# EAGLE design Adafruit MPR121Q QT (EAGLE 9.6.2)
COMPANY: ADAFRUIT INDUSTRIES; DRAWN: KTOWN; REV: A
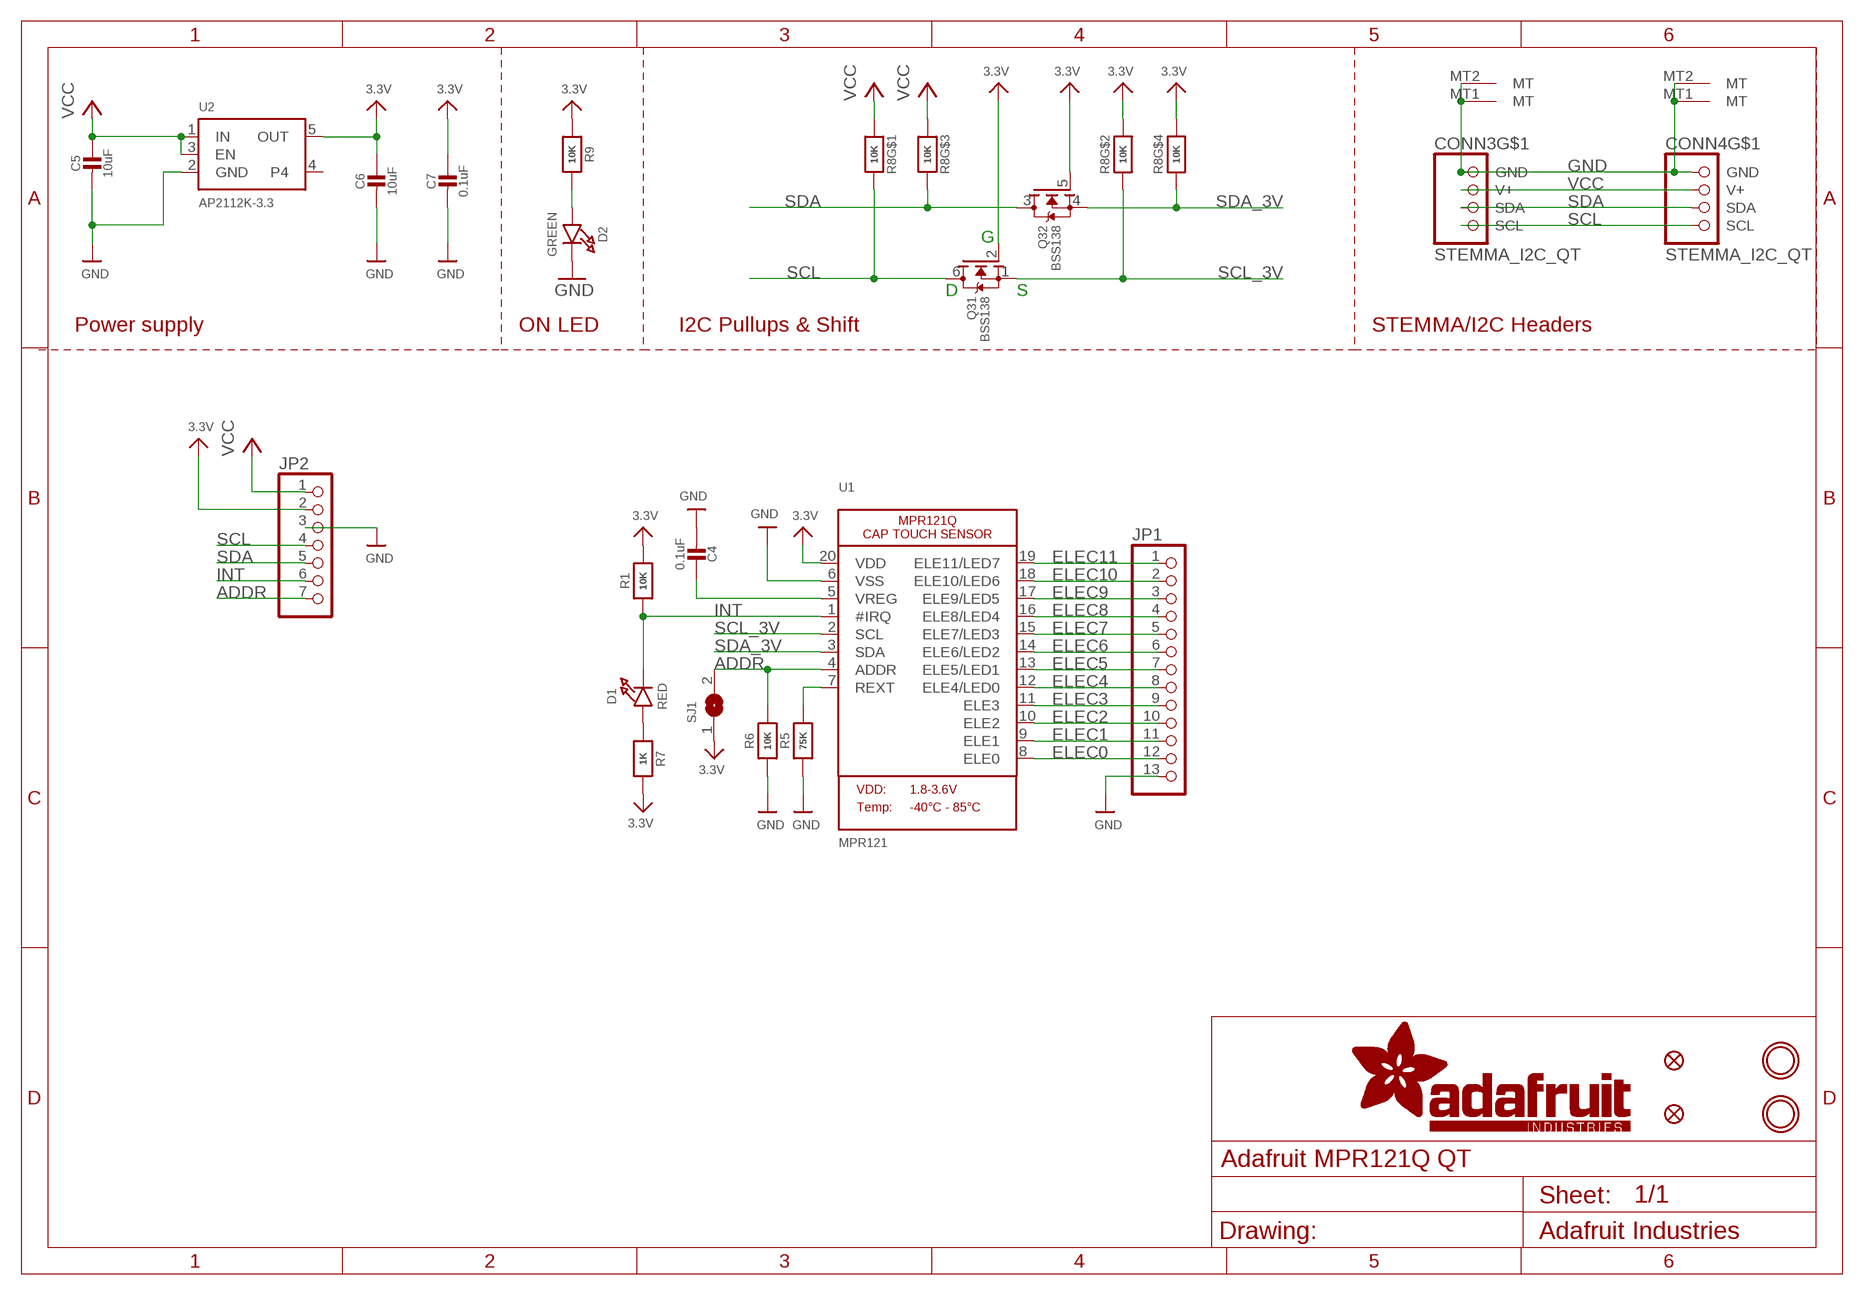
[diagram p0: schematic, sheet 1]

## Parts
C4  0.1uF  CAP_CERAMIC0603_NO  [0603-NO]
C5  10uF  CAP_CERAMIC0805-NOOUTLINE  [0805-NO]
C6  10uF  CAP_CERAMIC0805-NOOUTLINE  [0805-NO]
C7  0.1uF  CAP_CERAMIC0603_NO  [0603-NO]
CONN3  STEMMA_I2C_QT  [JST_SH4]
CONN4  STEMMA_I2C_QT  [JST_SH4]
D1  RED  LED0603_NOOUTLINE  [CHIPLED_0603_NOOUTLINE]
D2  GREEN  LED0603_NOOUTLINE  [CHIPLED_0603_NOOUTLINE]
FID3  FIDUCIAL_1MM  [FIDUCIAL_1MM]
FID4  FIDUCIAL_1MM  [FIDUCIAL_1MM]
JP1  HEADER-1X13  [1X13_ROUND_70]
JP2  HEADER-1X770MIL  [1X07_ROUND_70]
Q3  BSS138  MOSFET-N_DUAL  [SOT363]
R1  10K  RESISTOR_0603_NOOUT  [0603-NO]
R5  75K  RESISTOR_0603_NOOUT  [0603-NO]
R6  10K  RESISTOR_0603_NOOUT  [0603-NO]
R7  1K  RESISTOR_0603_NOOUT  [0603-NO]
R8  10K  RESISTOR_4PACK  [RESPACK_4X0603]
R9  10K  RESISTOR_0603_NOOUT  [0603-NO]
SJ1  SOLDERJUMPER  [SOLDERJUMPER_ARROW_NOPASTE]
U1  MPR121  MPR121Q  [QFN20_3MM_NOTHERMAL]
U2  AP2112K-3.3  VREG_SOT23-5  [SOT23-5]
U$34  MOUNTINGHOLE2.5  [MOUNTINGHOLE_2.5_PLATED]
U$35  MOUNTINGHOLE2.5  [MOUNTINGHOLE_2.5_PLATED]

## Nets
3.3V: C6.1 C7.1 JP2.2 Q3.2(1:G) Q3.5(2:G) R1.2 R7.2 R8.2 R8.4 R9.1 SJ1.1 U1.20(VDD) U2.5(OUT)
ADDR: JP2.7 R6.2 SJ1.2 U1.4(ADDR)
ELEC0: JP1.12 U1.8(ELE0)
ELEC1: JP1.11 U1.9(ELE1)
ELEC2: JP1.10 U1.10(ELE2)
ELEC3: JP1.9 U1.11(ELE3)
ELEC4: JP1.8 U1.12(ELE4/LED0)
ELEC5: JP1.7 U1.13(ELE5/LED1)
ELEC6: JP1.6 U1.14(ELE6/LED2)
ELEC7: JP1.5 U1.15(ELE7/LED3)
ELEC8: JP1.4 U1.16(ELE8/LED4)
ELEC9: JP1.3 U1.17(ELE9/LED5)
ELEC10: JP1.2 U1.18(ELE10/LED6)
ELEC11: JP1.1 U1.19(ELE11/LED7)
GND: C4.2 C5.2 C6.2 C7.2 CONN3.1(GND) CONN3.MT1(MT) CONN3.MT2(MT) CONN4.1(GND) CONN4.MT1(MT) CONN4.MT2(MT) D2.C JP1.13 JP2.3 R5.1 R6.1 U1.6(VSS) U2.2(GND)
INT: D1.C JP2.6 R1.1 U1.1(#IRQ)
N$1: D1.A R7.1
N$2: C4.1 U1.5(VREG)
N$3: R5.2 U1.7(REXT)
N$4: D2.A R9.2
SCL: CONN3.4(SCL) CONN4.4(SCL) JP2.4 Q3.6(1:D) R8.8
SCL_3V: Q3.1(1:S) R8.7 U1.2(SCL)
SDA: CONN3.3(SDA) CONN4.3(SDA) JP2.5 Q3.3(2:D) R8.6
SDA_3V: Q3.4(2:S) R8.5 U1.3(SDA)
VCC [highpower]: C5.1 CONN3.2(V+) CONN4.2(V+) JP2.1 R8.1 R8.3 U2.1(IN) U2.3(EN)
Unconnected: U2.4

## Notes on the sheet
- G
- D | S
- Power supply | ON LED | I2C Pullups & Shift | STEMMA/I2C Headers

## Library data of the parts
C4-C7 = microbuilder:CAP_CERAMIC: Ceramic Capacitors For new designs, use the packages preceded by an '_' character since they are more reliable: The following footprints should be used on most boards: _0402 - Standard footprint for regular board layouts _0603 - Standard footprint for regular board layouts _0805 - Standard footprint for regular board layouts _1206 - Standard footprint for regular board layouts For extremely tight-pitch boards where space is at a premium, the following 'micro-pitch' footprints can be used (smaller pads, no silkscreen outline, etc.): _0402MP - Micro-pitch footprint for very dense/compact boards _0603MP - Micro-pitch footprint for very dense/compact boards _0805MP - Micro-pitch footprint for very dense/compact boards _1206MP - Micro-pitch footprint for very dense/compact boards
CONN3 CONN4 = microbuilder:STEMMA_I2C
D1 D2 = microbuilder:LED: LED 0603 - 0603 Surface Mount Package 2mA: Green LED - Low Power (3.9mcd, 2ma, 1.7Vf) - Digikey: 475-2709-2-ND Orange LED - Low Power (9.8mcd, 2ma, 1.8Vf) - Digikey: 475-1194-2-ND Red LED - Low Power (5mcd, 2ma, 1.8Vf) - Digikey: 475-1195-2-ND Yellow LED - Low Power (7mcd, 2ma, 1.8Vf) - Digikey: 475-1196-2-ND 5mA: Blue LED - Low Power (17mcd, 5ma, 2.9Vf) - Digikey: LNJ937W8CRACT-ND 0805 - 0805 Surface Mount Package 2mA: Red LED (8.8mcd, 2mA, 1.8Vf, Clear) - Low Power [Digikey: 475-2510-1-ND] Green LED (5mcd, 2mA, 1.8Vf, Clear) - Low Power [Digikey: 475-2730-1-ND] Yellow LED (11.3mcd, 2mA, 1.8Vf, Clear) - Low Power [Digikey: 475-2555-1-ND] 20mA: Red LED (104mcd, 20mA, Diffused) - LS R976 [Digikey: 475-1278-6-ND] Red LED (12mcd, 20mA, 2.0Vf, Clear) - APT2012EC [Digikey: 754-1128-1-ND] Green LED (15mcd, 20mA, 2.2Vf, Clear) - APT2012GC [Digikey: 754-1131-1-ND] Orange LED (160mcd, 20mA, 2.1Vf, Clear) - APT2012SECK [Digikey: 754-1130-1-ND] 1206 - 1206 Surface Mount Package Green LED (26mcd, 20mA, Diffused) - LG N971 [Digikey: 475-1407-6-ND] Red LED (15mcd, 20mA, Diffused) - LH N974 [Digikey: 475-1416-6-ND] Cree - Cree High-Power Surface Mount LEDs XPEBWT-L1-0000-00D50 - White 111lm 350mA 2.9Vf 6200K 110° XTEAWT-00-0000-00000LEE3 - White 114lm 350mA 2.85Vf 5000K 115° Everlight - Everlight 45-21 Series Surface Mount LEDs 45-21/QK2C-B2832AC2CB2/2T - Warm White 2000mcd 20mA 3.25Vf 3050K 120° 45-21/LK2C-B38452C4CB2/2T - Nuetral White 2000mcd 20mA 3.25Vf 4150K 120° 45-21/LK2C-B50634C6CB2/2T - Cold White 2200mcd 20mA 3.25Vf 5650K 120° PLCC2 Reverse Mount LS T77K-J1L2-1-0-2-R18-Z - Red 11.25mcd 2mA 1.8Vf 630nm 120° LO T77K-L1M2-24-Z - Orange 19.6mcd 2mA 1.8Vf 606nm 120° LY T77K-K2M1-26-Z - Yellow 15.7mcd 2mA 1.8Vf 587nm 120°
FID3 FID4 = microbuilder:FIDUCIAL: Fiducial Alignment Points Various fiducial points for machine vision alignment.; BOM: EXCLUDE
JP1 = microbuilder:HEADER-1X13
JP2 = microbuilder:HEADER-1X7: PIN HEADER
Q3 = microbuilder:MOSFET-N_DUAL: Dual N-Channel MOSFET SOT363 (2.0x1.25mm) 2N7002PS - 60V, 320mA [Digikey: 568-5984-1-ND]
R1 R5 R6 R9 = microbuilder:RESISTOR: Resistors For new designs, use the packages preceded by an '_' character since they are more reliable: The following footprints should be used on most boards: _0402 - Standard footprint for regular board layouts _0603 - Standard footprint for regular board layouts _0805 - Standard footprint for regular board layouts _1206 - Standard footprint for regular board layouts For extremely tight-pitch boards where space is at a premium, the following 'micro-pitch' footprints can be used (smaller pads, no silkscreen outline, etc.): _0402MP - Micro-pitch footprint for very dense/compact boards _0603MP - Micro-pitch footprint for very dense/compact boards _0805MP - Micro-pitch footprint for very dense/compact boards _1206MP - Micro-pitch footprint for very dense/compact boards
R7 = microbuilder:RESISTOR: Resistors For new designs, use the packages preceded by an '_' character since they are more reliable: The following footprints should be used on most boards: _0402 - Standard footprint for regular board layouts _0603 - Standard footprint for regular board layouts _0805 - Standard footprint for regular board layouts _1206 - Standard footprint for regular board layouts For extremely tight-pitch boards where space is at a premium, the following 'micro-pitch' footprints can be used (smaller pads, no silkscreen outline, etc.): _0402MP - Micro-pitch footprint for very dense/compact boards _0603MP - Micro-pitch footprint for very dense/compact boards _0805MP - Micro-pitch footprint for very dense/compact boards _1206MP - Micro-pitch footprint for very dense/compact boards; REV: E
R8 = microbuilder:RESISTOR_4PACK: Resistor Packs (4 resistors) 4 x 0603 10K 1/16W - Digikey: YC164J-10KCT-ND
SJ1 = microbuilder:SOLDERJUMPER: SMD Solder JUMPER Solder the two pads together to create a connection, or remove the solder to break it. REFLOW - Use this footprint for solder paste and reflow ovens. WAVE - Use this footprint for hand-soldering (larger pads). CLOSED - Has a trace between the two pads to ensure it is closed by default. The trace needs to be cut to disable the jumper, and can be closed again by creating a solder bridge between the two pads.; BOM: EXCLUDE
U1 = microbuilder:MPR121Q: MPR121Q - 12 Electrode Cap Touch Sensor Can drive up to 8 LEDs
U2 = microbuilder:VREG_SOT23-5: SOT23-5 Fixed Voltage Regulators Part Current Out V Out V In V Dropout θJA (°C/W) TJ (°C) Digikey Part No. ADP121 150mA 3.3V 3.4-5.5V 0.09V @ 150mA -- -- ADP121-AUJZ33R7CT-ND ADP121 150mA 3.0V 3.1-5.5V 0.09V @ 150mA -- -- ADP121-AUJZ30R7CT-ND ADP122 300mA 3.3V 3.4-5.5V 0.085V @ 300mA -- -- ADP122AUJZ-3.3-R7CT-ND ADP1712 300mA 3.3V 3.5-5.5V 0.17V @ 300mA -- -- ADP1712AUJZ-3.3-R7TR-ND AP7311 (Low Cost) 150mA 3.3V 3.5-6V 0.15V @ 150mA -- -- AP7311-33WG-7DICT-ND LD39015M18R 150mA 1.8V 1.9V-5.5V 0.08V @ 100mA -- -- 497-6977-1-ND LP2985A-33DBVR 150mA 3.3V 3.3-16V 0.28V @ 150mA 206 150 296-18479-1-ND MCP1824T-3302E/OT 300mA 3.3V 3.5V-6V 0.2V @ 300mA -- -- MCP1824T-3302E/OTCT-ND MIC5205-2.5YM5 TR 150mA 2.5V 2.7-16V 0.165V @ 150mA -- -- 576-1257-2-ND MIC5205-3.0YM5 TR 150mA 3.0V 3.2V-16V 0.165V @ 150mA -- -- 576-1258-2-ND MIC5205-3.3YM5 TR 150mA 3.3V 3.5V-16V 0.165V @ 150mA -- -- 576-1259-2-ND TPS780330220 150mA 3.3V+2.2V 3.6-5.5V 250mV Max -- -- 296-23332-1-ND TDA3663/N1,135 100mA 3.3V 3.5-45V 0.18V @ 50mA -- -- 568-5343-1-ND Max operating temp can be calculated using θJA, TJ (max junction temperature), and power in watts. Set the "Maximum Ambient Temperature" until it reaches TJ ("Max Junction Temperature"), which is the absolute limit for safe use of the regulator: Heat Sink Temperature Calculator <http://www.daycounter.com/Calculators/Heat-Sink-Temperature-Calculator.phtml> For example, With 12V source into a 3.3V LP2985 and a 30mA load, we are dissipating (12V-3.3V) * 0.03A = 0.261W. With a θJA of 206 °C/W, a TJ of 150°C, and 261mW we can safely use the chip without a heat sink up to 75°C (=147.1°C Junction Temperature).
U$34 U$35 = microbuilder:MOUNTINGHOLE: Mounting Hole For #2 screws (0.086"/2.18mm width, 0.094"/2.4mm hole) use 2.5mm; BOM: EXCLUDE

## Net classes
1 highpower: width 0.305 mm, drill 0.483 mm
2 lowpower: width 0.254 mm, drill 0.483 mm

## Board
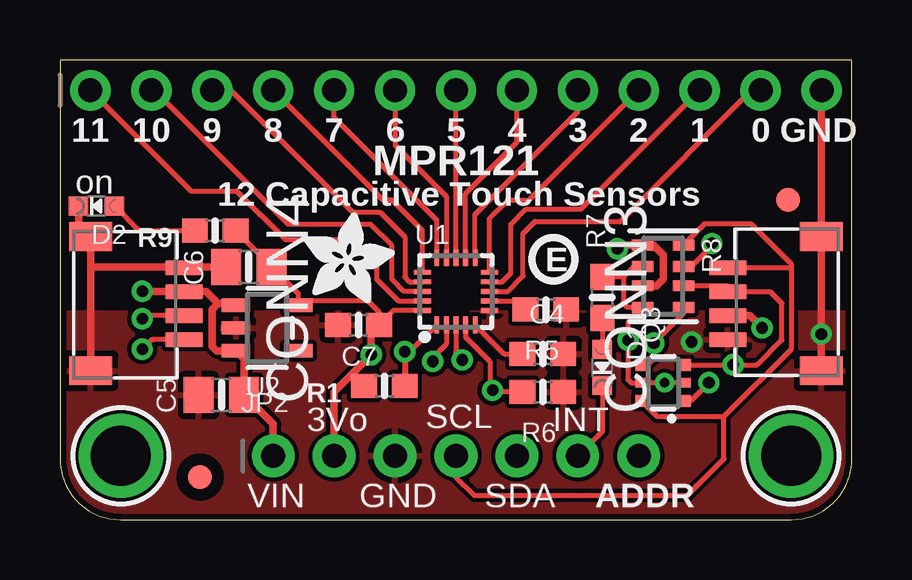
[diagram p1: board, top side]
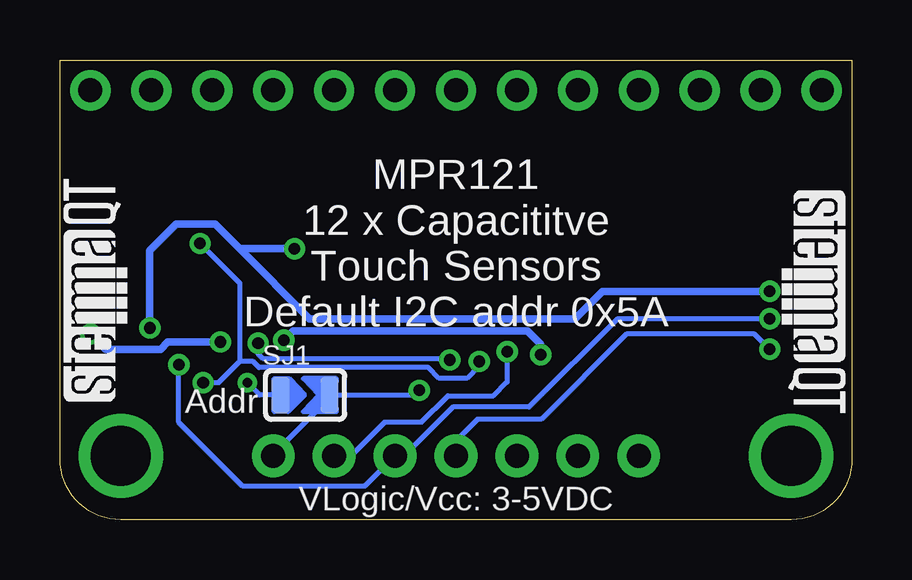
[diagram p2: board, bottom side, seen from below]

Size 33.02 x 19.18 mm. Coordinates in mm from the lower left corner, seen from the top.
Outline: 33.02,2.54 33.02,19.18 0,19.18 0,2.54 arc90 2.54,0 30.48,0 arc90 33.02,2.54
Copper layers (1*16): Top 0.035mm / dielectric 1.5mm / Bottom 0.035mm
Design rules "adafruit *": minimum track width 7mil, minimum drill 15.5mil, track to track 7mil, track to pad 7mil, pad to pad 7mil, via to via 7mil, smd to smd 6mil, copper to edge 10mil, drill to drill 8mil, minimum pad ring 10mil, minimum via ring 8mil, stop-mask expansion 2mil, vias tented up to drill 20mil, thermal gap 10mil

### Footprints (pad centres in the part's own frame; a part is rotated, then mirrored left to right if it is on the bottom)
0603-NO = smd 1.075 x 1: 1 -0.85,0; 2 0.85,0
0805-NO = smd 1.24 x 1.5: 1 -0.95,0; 2 0.95,0
JST_SH4 = smd 0.6 x 1.55: 1 -1.5,2.514; 2 -0.5,2.514; 3 0.5,2.514; 4 1.5,2.514 | smd 1.2 x 1.8: MT1 -2.8,-1.386; MT2 2.8,-1.386
CHIPLED_0603_NOOUTLINE = smd 0.8 x 0.8: A 0,-0.75; C 0,0.75
FIDUCIAL_1MM = smd 1 x 1: 1 0,0
1X13_ROUND_70 = drill 1 pad 1.676: 1 -15.24,0; 2 -12.7,0; 3 -10.16,0; 4 -7.62,0; 5 -5.08,0; 6 -2.54,0; 7 0,0; 8 2.54,0; 9 5.08,0; 10 7.62,0; 11 10.16,0; 12 12.7,0; 13 15.24,0
1X07_ROUND_70 = drill 1 pad 1.778: 1 -7.62,0; 2 -5.08,0; 3 -2.54,0; 4 0,0; 5 2.54,0; 6 5.08,0; 7 7.62,0
SOT363 = smd 0.5 x 0.5: 1 -0.75,-0.9; 3 0.75,-0.9; 4 0.75,0.9; 6 -0.75,0.9 | smd 0.4 x 0.5: 2 0,-0.9; 5 0,0.9
RESPACK_4X0603 = smd 0.45 x 0.9: 1 -1.3,-0.85; 2 -0.4,-0.85; 3 0.4,-0.85; 4 1.3,-0.85; 5 1.3,0.85; 6 0.4,0.85; 7 -0.4,0.85; 8 -1.3,0.85
SOLDERJUMPER_ARROW_NOPASTE = smd 0.762 x 1.524: 1 -1.016,0; 2 1.016,0
QFN20_3MM_NOTHERMAL = smd 0.7 x 0.2: 1 -1.4,0.8; 2 -1.4,0.4; 3 -1.4,0; 4 -1.4,-0.4; 5 -1.4,-0.8; 11 1.4,-0.8; 12 1.4,-0.4; 13 1.4,0; 14 1.4,0.4; 15 1.4,0.8 | smd 0.2 x 0.7: 6 -0.8,-1.4; 7 -0.4,-1.4; 8 0,-1.4; 9 0.4,-1.4; 10 0.8,-1.4; 16 0.8,1.4; 17 0.4,1.4; 18 0,1.4; 19 -0.4,1.4; 20 -0.8,1.4
SOT23-5 = smd 0.55 x 1.2: 1 -0.95,-1.3; 2 0,-1.3; 3 0.95,-1.3; 4 0.95,1.3; 5 -0.95,1.3
MOUNTINGHOLE_2.5_PLATED = drill 2.5 pad 3.2: P$1 0,0

### Placement (x,y rotation side)
C4  20.13,6.92 0 top
C5  6.73,5.21 180 top
C6  7.87,10.54 180 top
C7  12.45,8.13 180 top
CONN3  30.35,9.02 90 top
CONN4  2.67,9.02 270 top
D1  22.61,6.35 180 top
D2  1.52,13.08 90 top
FID3  5.84,1.78 0 top
FID4  30.35,13.34 0 top
JP1  16.51,17.91 0 top
JP2  16.51,2.67 0 top
Q3  25.15,5.71 90 top
R1  13.53,5.59 180 top
R5  20.26,8.76 180 top
R6  20.13,5.33 180 top
R7  22.61,9.27 90 top
R8  25.15,10.16 270 top
R9  6.48,12.07 180 top
SJ1  22.8,5.21 0 bottom
U1  16.51,9.53 90 top
U2  8.64,8 270 top
U$9  [PCBFEAT-REV-040]  20.57,10.86 0 top
U$34  2.54,2.67 0 top
U$35  30.48,2.67 0 top
U$37  [ADAFRUIT_3.5MM]  10.16,9.02 0 top
U$39  [STEMMAQT]  30.23,4.95 90 bottom
U$40  [STEMMAQT]  2.92,13.72 270 bottom

### Tracks (layer width: path | path; a pad name or v marks a point on that pad's centre or on a via)
3.3V  (via drill 0.39, 0.48)
  Top 0.203: U1.20 13.89,8.73 C7.1 13.3,8.68 12.83,9.14 10.13,9.14 U2.5 9.94,9.43 C6.1 8.82,10.57 R9.1 | Q3.2 v25.21,5.71 Q3.5 23.82,5.71 23.69,5.85 v23.69,7.49 23.69,8.25 R8.4 23.65,8.86 23.5,9.02 23.5,10.12 | R8.2 23.93,10.56 23.5,10.12 | 23.5,10.12 R7.2
  Top 0.254: R1.2 12.51,5.59 12.1,6
  Top 0.305: JP2.2 11.43,5.33 12.1,6 v12.98,6.88 12.98,7.81 C7.1
  Bottom 0.203: SJ1.1 24.7,5.21 v25.21,5.71
  Bottom 0.305: v12.98,6.88 12.98,7.33 13.53,7.87 23.3,7.87 v23.69,7.49
ADDR  (via drill 0.48)
  Top 0.203: U1.4 16.91,7.62 17.93,6.6 17.93,5.5 v18.03,5.4 18.1,5.33 R6.2
  Bottom 0.203: 21.65,5.21 18.16,5.21 18.03,5.33 v18.03,5.4 | JP2.7 24.13,2.73 21.65,5.21 | SJ1.2 21.65,5.21
ELEC0
  Top 0.203: U1.8 18.67,9.53 19.3,10.16 19.3,11.94 19.81,12.45 23.37,12.45 28.83,17.91 JP1.12
ELEC1
  Top 0.203: U1.9 18.43,9.93 18.8,10.29 18.8,12.32 19.43,12.95 21.72,12.95 JP1.11
ELEC2
  Top 0.203: U1.10 17.91,12.58 18.67,13.34 19.56,13.34 JP1.10
ELEC3
  Top 0.203: U1.11 17.31,12.74 21.59,17.02 JP1.9
ELEC4
  Top 0.203: U1.12 16.91,13.61 19.05,15.75 JP1.8
ELEC5
  Top 0.203: U1.13 JP1.7
ELEC6
  Top 0.203: JP1.6 13.97,15.62 16.11,13.48 U1.14
ELEC7
  Top 0.203: U1.15 15.71,12.48 11.43,16.76 JP1.5
ELEC8
  Top 0.203: U1.16 15.11,12.07 13.84,13.34 13.46,13.34 JP1.4
ELEC9
  Top 0.203: JP1.3 7.11,17.91 12.19,12.83 13.34,12.83 14.38,11.78 14.38,10.12 14.57,9.93 U1.17
ELEC10
  Top 0.203: U1.18 14.35,9.53 13.84,10.03 13.84,11.43 12.95,12.32 9.53,12.32 3.94,17.91 JP1.2
ELEC11
  Top 0.203: JP1.1 5.46,13.72 7.37,13.72 9.4,11.68 12.19,11.68 13.21,10.67 13.21,10.03 14.12,9.12 U1.19
GND  (via drill 0.48)
  Top 0.305: D2.C 0.77,11.82 CONN4.MT1 | CONN4.MT1 1.28,11.13 | C6.2 5.18,10.54 CONN4.1 5.16,10.54 1.28,10.54 | CONN4.MT1 1.28,10.54 | 1.28,10.54 CONN4.MT2 | CONN3.MT1 v31.74,7.75 CONN3.MT2 31.74,17.9 JP1.13 | 26.36,7.39 v26.34,7.42
  Bottom 0.305: v26.34,7.42 28.53,7.42 28.83,7.11 31.1,7.11 v31.74,7.75
  pour Top: 0,8.64 33.02,8.64 33.02,0 0,0
INT  (via drill 0.48)
  Top 0.203: U1.1 14.6,7.01 v14.38,7.01 | D1.C 22.61,3.68 JP2.6
  Top 0.254: v14.38,7.01 R1.1
  Bottom 0.203: v14.38,7.01 14.38,5.74 14.95,5.17 16.85,5.17 17.96,4.06 19.49,4.06 20.89,2.67 JP2.6
N$1
  Top 0.203: R7.1 D1.A
N$2
  Top 0.203: U1.5 18.51,6.92 C4.1
N$3
  Top 0.203: U1.7 19.04,9.12 R5.2
N$4
  Top 0.203: D2.A 3.29,12.07 R9.2
SCL  (via drill 0.48)
  Top 0.203: R8.8 26.89,12.35 28.8,12.35 30.48,10.67 30.48,10.54 | Q3.6 24.89,4.32 27.69,4.32 | 27.69,4.32 30.48,7.11 30.48,10.54 | CONN4.4 3.83,7.52 v3.43,7.11 | JP2.4 16.51,1.78 17.27,1.02 26.16,1.02 27.69,2.54 27.69,4.32 | 30.48,10.54 30.46,10.52 CONN3.4
  Bottom 0.203: v3.43,7.11 4.06,7.75 9.4,7.75 12.95,4.19 15.62,4.19 16.51,3.3 JP2.4
SCL_3V  (via drill 0.48)
  Top 0.203: U1.2 16.11,7.33 15.54,6.77 v15.54,6.6 | v27.05,5.71 26.3,4.96 Q3.1 | R8.7 26.32,10.56 27.18,11.42 v27.18,11.52
  Bottom 0.203: v15.54,6.6 15.54,6.41 16.05,5.91 17.21,5.91 17.65,6.35 24.72,6.35 24.98,6.6 25.53,6.6 | v27.18,11.52 25.53,9.87 25.53,6.6 | v27.05,5.71 26.42,5.71 25.53,6.6
SDA  (via drill 0.48)
  Top 0.203: R8.6 27.84,9.76 CONN3.3 29.6,9.52 30.1,9.02 30.1,7.49 29.07,6.46 v28.07,6.46 Q3.3 | CONN4.3 3.56,8.52 v3.43,8.38
  Bottom 0.203: v3.43,8.38 9.78,8.38 13.46,4.7 16.64,4.7 18.67,2.67 JP2.5 20.32,1.4 25.4,1.4 28.07,4.06 v28.07,6.46
SDA_3V  (via drill 0.48)
  Top 0.203: Q3.4 24.49,6.46 24.76,6.74 v24.76,7.37 26,8.61 R8.5 | U1.3 16.51,7.01 16.76,6.75 v16.76,6.67
  Bottom 0.203: v16.76,6.67 16.83,6.73 24.57,6.73 24.76,6.93 v24.76,7.37
VCC  (via drill 0.48)
  Top 0.305: JP2.1 8.89,4 C5.1 7.68,6.71 U2.3 6.54,7.05 6.35,7.24 6.35,8.76 6.6,9.02 | R8.3 24.87,9.76 25.15,10.03 25.15,11.05 24.73,11.46 R8.1 23.4,11.46 v23.24,11.3 | 29.01,8.26 v29.27,8 28.76,8.52 CONN3.2 | v3.43,9.53 v3.44,9.52 CONN4.2 6.1,9.52 6.6,9.02 | 6.6,9.02 7.27,9.02 U2.1
  Bottom 0.305: v29.27,8 29.27,11.24 28.18,12.34 26.56,12.34 25.53,11.3 | v23.24,11.3 25.53,11.3 | v3.43,9.53 10.41,9.53 11.56,8.38 22.61,8.38 25.53,11.3

### Text on the board
tPlace: 11 | 10 | 9 | 8 | 7 | 6 | 5 | 4 | 3 | 2 | 1 | 0 | GND | MPR121 | on | 12 Capacitive Touch Sensors | 3Vo | SCL | INT | VIN | GND | SDA | ADDR
bPlace: MPR121 / 12 x Capacititve / Touch Sensors / Default I2C addr 0x5A | Addr | VLogic/Vcc: 3-5VDC